# EAGLE design BLE113 (EAGLE 7.2.0)
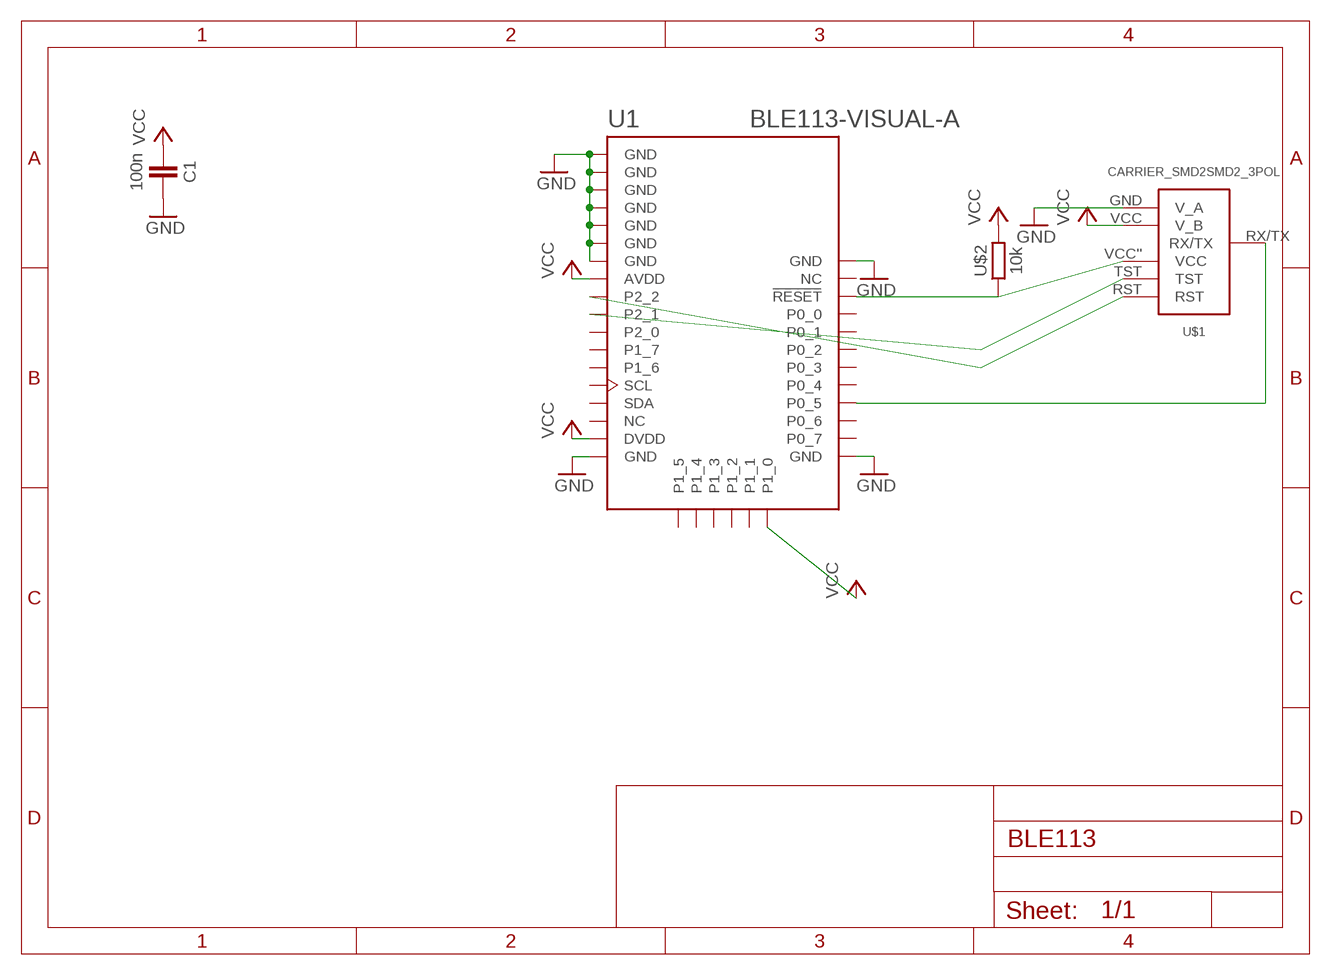
[diagram p0: schematic, sheet 1]

## Parts
C1  100n  CAPACITOR  [603]
U1  BLE113-VISUAL-A  [BLE113-A]
U$1  CARRIER_SMD2SMD2_3POL  [CARRIER_SMD2_3POL]
U$2  10k  RESISTOR0603  [603]

## Nets
GND: C1.2 U1.GND U1.GND@2(GND) U1.GND@3(GND) U1.GND@4(GND) U1.GND@5(GND) U1.GND@6(GND) U1.GND@7(GND) U1.GND@8(GND) U1.GND@9(GND) U1.GND@10(GND) U$1.GND(V_A)
N$2: U1.RESET U$1.VCC''(VCC) U$2.1
N$3: U1.P2_2 U$1.RST
N$4: U1.P2_1 U$1.TST
N$12: U1.P0_5 U$1.RX/TX
VCC: C1.1 U1.AVDD U1.DVDD U1.P1_0 U$1.VCC(V_B) U$2.2
Unconnected: U1.NC U1.NC@2(NC) U1.P0_0 U1.P0_1 U1.P0_2 U1.P0_3 U1.P0_4 U1.P0_6 U1.P0_7 U1.P1_1 U1.P1_2 U1.P1_3 U1.P1_4 U1.P1_5 U1.P1_6 U1.P1_7 U1.P2_0 U1.SCL U1.SDA

## Library data of the parts
C1 = thar:CAPACITOR
U1 = sf-bluegiga:BLE113-VISUAL: Bluetooth Low Energy single-mode module - Bluetooth 4.0 (CC2541). BLE113-A variant has an on-module ceramic chip antenna. BLE113-A variant includes keepout/restrict area. Antenna edge of the module should be flush up against the edge of the PCB. See datasheet for variant layout details. The BLE113 is a Bluetooth Smart module targeted for small and low-power sensors and accessories. It integrates all features required for a Bluetooth Smart application, including Bluetooth radio, software stack, and GATT-based profiles. The BLE113 Bluetooth Smart module can also host end-user applications, which means no external micro controller is required in size or price constrained devices. Moreover, it has flexible hardware interfaces to connect to different peripherals and sensors and can be powered directly from a standard 3V coin cell battery or a pair of AAA batteries. In the lowest power sleep mode it merely consumes 500 nA and will wake up within a few hundred microseconds. The BLE113 Bluetooth Smart module conusmer approximately 30% less power and is smaller than the BLE112 Bluetooth Smart Module. http://www.bluegiga.com/en-US/products/bluetooth-4.0-modules/ble113-bluetooth--smart-module https://github.com/jrowberg/sf-oshw Last updated 2014-01-04 by Jeff Rowberg <jeff@rowberg.net>; ANTENNA: On-module ceramic chip antenna
U$1 = thar:CARRIER_SMD2
U$2 = thar:RESISTOR

## Board
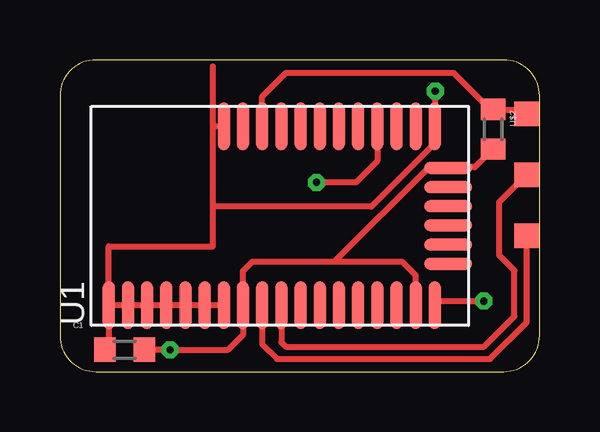
[diagram p1: board, top side]
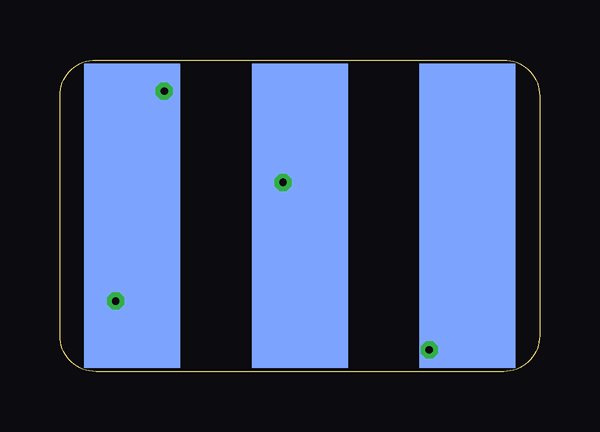
[diagram p2: board, bottom side, seen from below]

Size 20 x 13 mm. Coordinates in mm from the lower left corner, seen from the top.
Copper layers (1*16): Top 0.035mm / dielectric 1.5mm / Bottom 0.035mm
Design rules "Bilex DRU *": minimum track width 10mil, minimum drill 24mil, track to track 10mil, track to pad 10mil, pad to pad 10mil, via to via 10mil, smd to smd 10mil, copper to edge 1mil, drill to drill 8mil, minimum pad ring 10mil, minimum via ring 8mil, stop-mask expansion 4mil, vias tented up to drill 0mil, thermal gap 10mil

### Footprints (pad centres in the part's own frame; a part is rotated, then mirrored left to right if it is on the bottom)
603 = smd 0.889 x 1.016: 1 -0.826,0; 2 0.826,0
BLE113-A = smd 2 x 0.5: AVDD -3.725,1.538; DVDD -3.725,-5.662; GND -3.725,7.138; GND@2 -3.725,6.338; GND@3 -3.725,5.537; GND@4 -3.725,4.737; GND@5 -3.725,3.938; GND@6 -3.725,3.138; GND@7 -3.725,2.337; GND@8 -3.725,-6.463; GND@9 3.725,-6.463; GND@10 3.725,2.337; NC -3.725,-4.862; NC@2 3.725,1.538; P0_0 3.725,-0.062; P0_1 3.725,-0.863; P0_2 3.725,-1.663; P0_3 3.725,-2.462; P0_4 3.725,-3.263; P0_5 3.725,-4.062; P0_6 3.725,-4.862; P0_7 3.725,-5.662; P1_6 -3.725,-2.462; P1_7 -3.725,-1.663; P2_0 -3.725,-0.863; P2_1 -3.725,-0.062; P2_2 -3.725,0.738; RESET 3.725,0.738; SCL -3.725,-3.263; SDA -3.725,-4.062 | smd 0.5 x 2: P1_0 2,-7.013; P1_1 1.2,-7.013; P1_2 0.4,-7.013; P1_3 -0.4,-7.013; P1_4 -1.2,-7.013; P1_5 -2,-7.013
CARRIER_SMD2_3POL = smd 4 x 12.7 bottom: GND -6.985,0; RX/TX 6.985,0; VCC 0,0 | smd 1.016 x 1.016: RST -9.461,0.826; TST -9.461,-1.714; VCC'' -9.461,-4.255

### Placement (x,y rotation side)
C1  2.7,0.91 180 top
U1  9.17,6.5 90 top
U$1  10,6.5 180 top
U$2  18.06,10.11 270 top

### Tracks (layer width: path | path; a pad name or v marks a point on that pad's centre or on a via)
GND  (via drill 0.3)
  Top 0.254: U1.GND U1.GND@2 U1.GND@3 U1.GND@4 U1.GND@5 U1.GND@6 U1.GND@7 | U1.GND 2.03,5.23 6.38,5.23 6.38,6.88 | 6.38,6.88 6.38,10.22 | 6.38,10.22 6.38,12.72 | U1.GND@10 6.38,10.22 | U1.GND 2.03,0.81 2.06,0.91 C1.2 | U1.GND@8 15.63,2.93 15.65,2.94 v17.68,2.94 | U1.GND@9 15.63,10.16 | 6.38,6.88 12.98,6.88 15.63,9.53 15.63,10.16 | 15.63,10.16 15.65,10.18 v15.65,11.7
  Bottom 0.254: 18,6.5 17.81,6.69 17.8,7.01 17.81,7.01 | 18.06,2.69 17.81,7 17.81,7.01 | 16.79,6.21 17.55,5.45 v17.68,2.94 17.55,6.5 17.05,7.01 17.81,7.01 | 16.79,6.21 16.5,6.5 | v15.65,11.7 16.79,6.21
N$2
  Top 0.254: U$1.VCC'' 19.28,10.93 U$2.1 17.81,10.93 17.81,11.07 16.4,12.47 9.43,12.47 8.43,11.47 U1.RESET
N$3
  Top 0.254: U1.P2_2 8.43,1.14 9.04,0.53 17.93,0.53 19.46,2.05 U$1.RST
N$4
  Top 0.254: U1.P2_1 9.23,1.23 9.43,1.04 17.68,1.04 18.95,2.31 18.95,4.21 18.32,4.85 18.32,7.07 U$1.TST
N$12  (via drill 0.3)
  Top 0.254: U1.P0_5 13.23,8.78 12.35,7.89 v10.7,7.89
  Bottom 0.254: v10.7,7.89 10.7,7.2 10,6.5
VCC  (via drill 0.3)
  Top 0.254: U$2.2 17.3,8.53 16.22,8.53 U1.P1_0 15.36,8.5 11.46,4.59 | C1.1 v4.6,0.91 7.01,0.91 7.63,1.53 U1.AVDD 7.63,4.2 8.03,4.59 11.46,4.59 | 11.46,4.59 14.25,4.59 14.83,4.01 U1.DVDD
  Bottom 0.254: 3.5,6.5 3.5,2.26 v4.6,0.91